# EAGLE design brelok_ext (EAGLE 8.3.2)
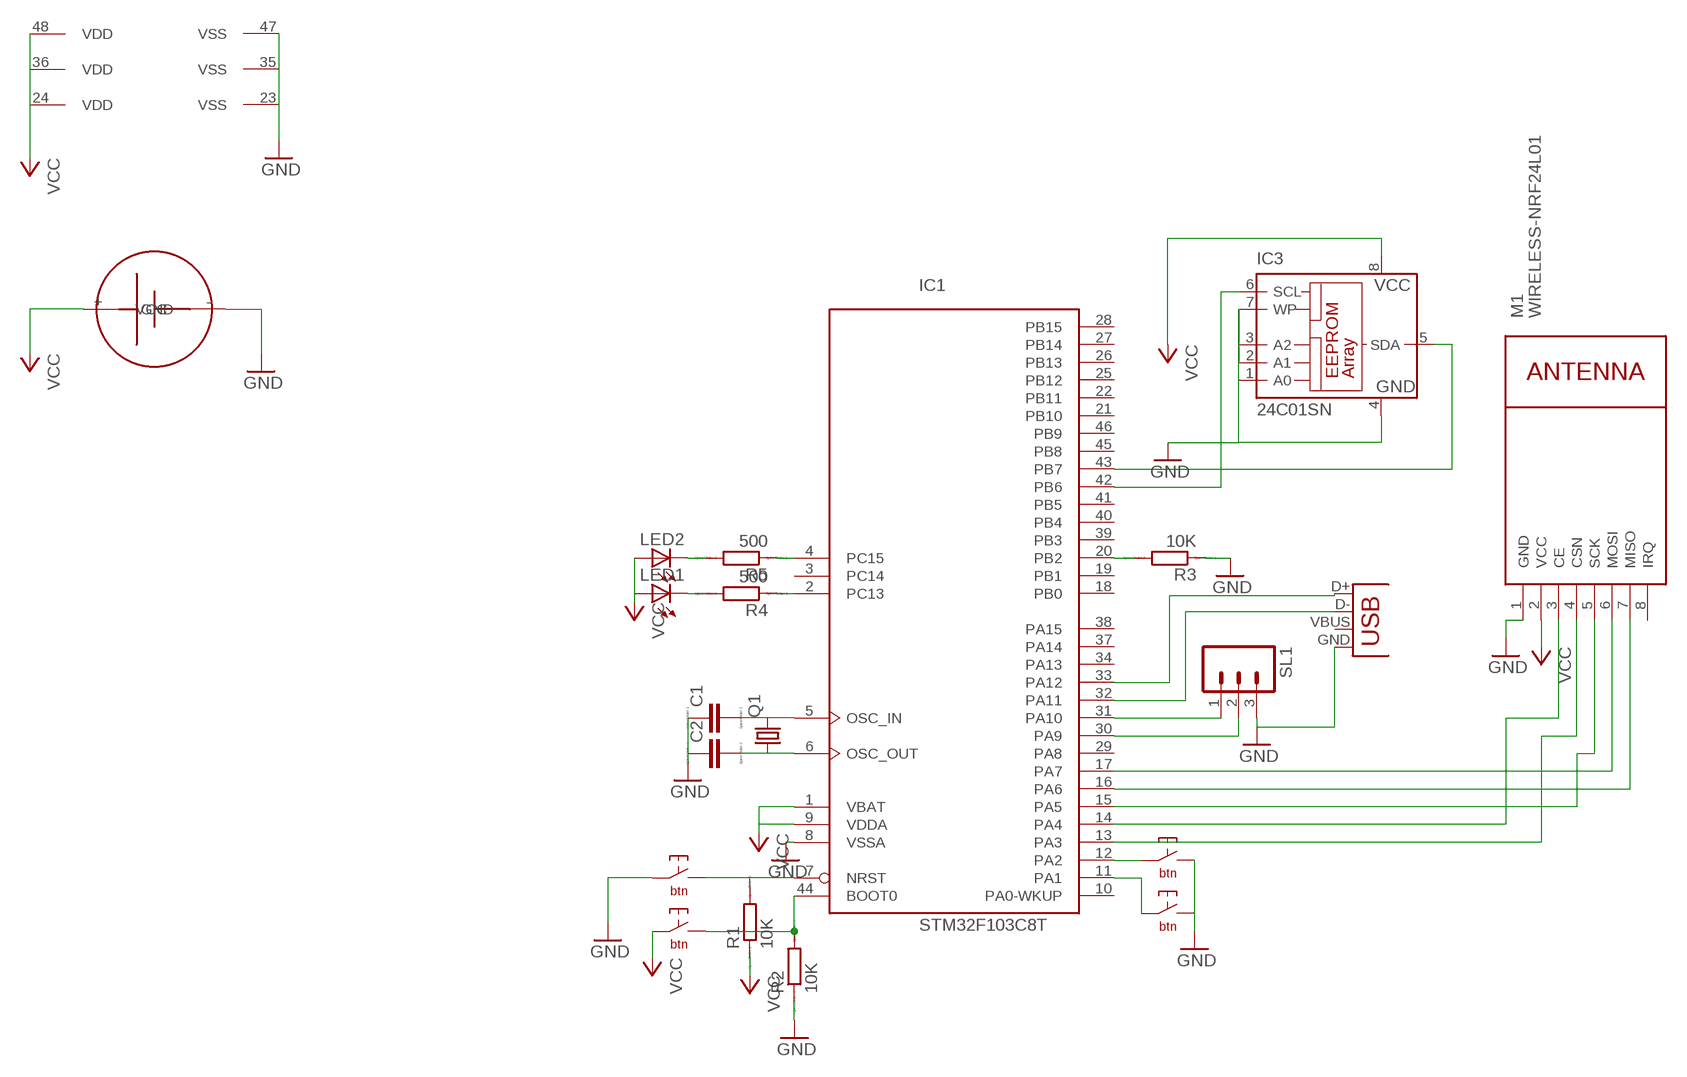
[diagram p0: schematic, sheet 1]

## Parts
BOOT  TM1103  [TM1103]
C1  CC0504  [C0504]
C2  CC0504  [C0504]
IC1  STM32F103C8T  [LQFP48]
IC3  24C01SN  [SO-08]
LED1  LEDCHIP-LED0805  [CHIP-LED0805]
LED2  LEDCHIP-LED0805  [CHIP-LED0805]
M1  WIRELESS-NRF24L01  [WIRELESS-NRF24L01]
Q1  CRYSTALHC49UP  [HC49UP]
R1  10K  R  [R0805]
R2  10K  R  [R0805]
R3  10K  R  [R0805]
R4  500  R  [R0805]
R5  500  R  [R0805]
RESET  TM1103  [TM1103]
SL1  M03  [03P]
U$2  CR2025_SMD  [SMD]
USER1  TM1103  [TM1103]
USER2  TM1103  [TM1103]
X1  SPARKFUN_USB-MICROB  [SPARKFUN_USB-MICROB]

## Nets
GND: C1.1 C2.1 IC1.8(VSSA) IC1.23(VSS) IC1.35(VSS) IC1.47(VSS) IC3.1(A0) IC3.2(A1) IC3.3(A2) IC3.4(GND) IC3.7(WP) M1.1(GND) R2.1 R3.1 RESET.P$2 SL1.3 U$2.-(GND) USER1.P$1 USER2.P$1 X1.GND
N$1: IC1.17(PA7) M1.6(MOSI)
N$2: IC1.16(PA6) M1.7(MISO)
N$3: IC1.15(PA5) M1.5(SCK)
N$4: IC1.14(PA4) M1.3(CE)
N$5: IC1.13(PA3) M1.4(CSN)
N$6: C1.2 IC1.5(OSC_IN) Q1.2
N$7: C2.2 IC1.6(OSC_OUT) Q1.1
N$8: IC1.7(NRST) R1.2 RESET.P$1
N$9: BOOT.P$1 IC1.44(BOOT0) R2.2
N$10: IC1.31(PA10) SL1.1
N$11: IC1.20(PB2) R3.2
N$12: IC1.30(PA9) SL1.2
N$13: LED1.C R4.2
N$14: LED2.C R5.2
N$15: IC1.4(PC15) R5.1
N$16: IC1.2(PC13) R4.1
N$18: IC1.12(PA2) USER2.P$2
N$19: IC1.11(PA1) USER1.P$2
N$21: IC1.42(PB6) IC3.6(SCL)
N$22: IC1.43(PB7) IC3.5(SDA)
N$23: IC1.32(PA11) X1.D-
N$24: IC1.33(PA12) X1.D+
VCC: BOOT.P$2 IC1.1(VBAT) IC1.9(VDDA) IC1.24(VDD) IC1.36(VDD) IC1.48(VDD) IC3.8(VCC) LED1.A LED2.A M1.2(VCC) R1.1 U$2.+(VCC)
Unconnected: IC1.3(PC14) IC1.10(PA0-WKUP) IC1.18(PB0) IC1.19(PB1) IC1.21(PB10) IC1.22(PB11) IC1.25(PB12) IC1.26(PB13) IC1.27(PB14) IC1.28(PB15) IC1.29(PA8) IC1.34(PA13) IC1.37(PA14) IC1.38(PA15) IC1.39(PB3) IC1.40(PB4) IC1.41(PB5) IC1.45(PB8) IC1.46(PB9) M1.8(IRQ) X1.VBUS

## Library data of the parts
BOOT RESET USER1 USER2 = tm1103:TM1103
C1 C2 = eagle-ltspice:C: CAPACITOR, European symbol; SPICEMODEL: NONE; SPICEPREFIX: C
IC1 = micro-stm_v2:STM32F103C*T: ARM 32-bit Cortex™-M3 CPU 72 MHz maximum frequency 16 to 128 Kbytes of Flash memory 6 to 20 kbytes of SRAM 37 GPIOs 2.0 to 3.6 V application supply
IC3 = microchip:24C*: Serial EEPROM 1 K/2 K/4 K; MPN: CAT24C01WI-GT3; OC_FARNELL: 1718117; OC_NEWARK: 06R0487
LED1 LED2 = led:LED: LED OSRAM: - CHIPLED LG R971, LG N971, LY N971, LG Q971, LY Q971, LO R971, LY R971 LH N974, LH R974 LS Q976, LO Q976, LY Q976 LO Q996 - Hyper CHIPLED LW Q18S LB Q993, LB Q99A, LB R99A - SideLED LS A670, LO A670, LY A670, LG A670, LP A670 LB A673, LV A673, LT A673, LW A673 LH A674 LY A675 LS A676, LA A676, LO A676, LY A676, LW A676 LS A679, LY A679, LG A679 - Hyper Micro SIDELED® LS Y876, LA Y876, LO Y876, LY Y876 LT Y87S - SmartLED LW L88C, LW L88S LB L89C, LB L89S, LG L890 LS L89K, LO L89K, LY L89K LS L896, LA L896, LO L896, LY L896 - TOPLED LS T670, LO T670, LY T670, LG T670, LP T670 LSG T670, LSP T670, LSY T670, LOP T670, LYG T670 LG T671, LOG T671, LSG T671 LB T673, LV T673, LT T673, LW T673 LH T674 LS T676, LA T676, LO T676, LY T676, LB T676, LH T676, LSB T676, LW T676 LB T67C, LV T67C, LT T67C, LS T67K, LO T67K, LY T67K, LW E67C LS E67B, LA E67B, LO E67B, LY E67B, LB E67C, LV E67C, LT E67C LW T67C LS T679, LY T679, LG T679 LS T770, LO T770, LY T770, LG T770, LP T770 LB T773, LV T773, LT T773, LW T773 LH T774 LS E675, LA E675, LY E675, LS T675 LS T776, LA T776, LO T776, LY T776, LB T776 LHGB T686 LT T68C, LB T68C - Hyper Mini TOPLED® LB M676 - Mini TOPLED Santana® LG M470 LS M47K, LO M47K, LY M47K Source: http://www.osram.convergy.de LUXEON: - LUMILED® LXK2-PW12-R00, LXK2-PW12-S00, LXK2-PW14-U00, LXK2-PW14-V00 LXK2-PM12-R00, LXK2-PM12-S00, LXK2-PM14-U00 LXK2-PE12-Q00, LXK2-PE12-R00, LXK2-PE12-S00, LXK2-PE14-T00, LXK2-PE14-U00 LXK2-PB12-K00, LXK2-PB12-L00, LXK2-PB12-M00, LXK2-PB14-N00, LXK2-PB14-P00, LXK2-PB14-Q00 LXK2-PR12-L00, LXK2-PR12-M00, LXK2-PR14-Q00, LXK2-PR14-R00 LXK2-PD12-Q00, LXK2-PD12-R00, LXK2-PD12-S00 LXK2-PH12-R00, LXK2-PH12-S00 LXK2-PL12-P00, LXK2-PL12-Q00, LXK2-PL12-R00 Source: www.luxeon.com KINGBRIGHT: KA-3528ASYC Source: www.kingbright.com
M1 = diy-modules:WIRELESS-NRF24L01: 2.4 GHz Wireless Module based on NRF24L01 chip More details available here: http://www.electrodragon.com/w/NRF24L01 Click here to find device on ebay.com <http://www.ebay.com/sch/nrf24l01+arduino>
Q1 = crystal:CRYSTAL: CRYSTAL; OC_FARNELL: unknown; OC_NEWARK: unknown
R1-R5 = eagle-ltspice:R: RESISTOR, European symbol; SPICEMODEL: NONE; SPICEPREFIX: R
SL1 = con-amp-quick:M03: AMP QUICK CONNECTOR; OC_FARNELL: unknown; OC_NEWARK: unknown
U$2 = CR2025:CR2025_SMD
X1 = antduino:SPARKFUN_USB: USB Connectors USB-B-PTH is fully proven SKU : PRT-00139 USB-miniB is fully proven SKU : PRT-00587 USB-A-PCB is untested. USB-A-H is throughly reviewed, but untested. Spark Fun Electronics SKU : PRT-00437 USB-B-SMT is throughly reviewed, but untested. Needs silkscreen touching up. USB-A-S has not been used/tested USB-MB-H has not been used/tested

## Board
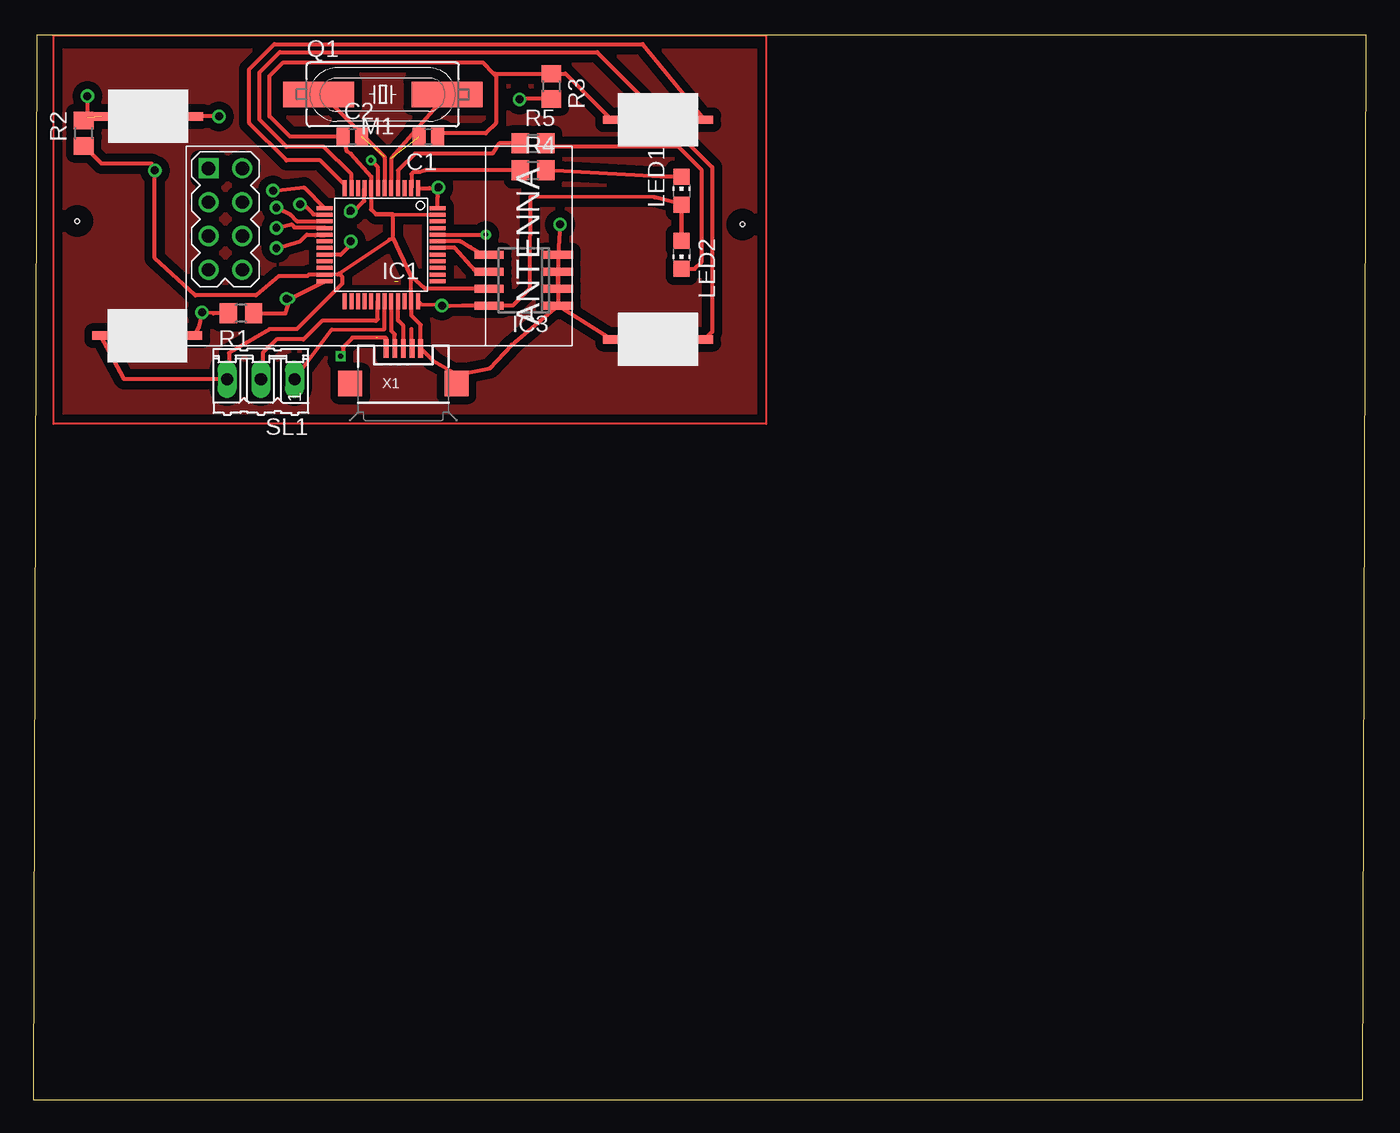
[diagram p1: board, top side]
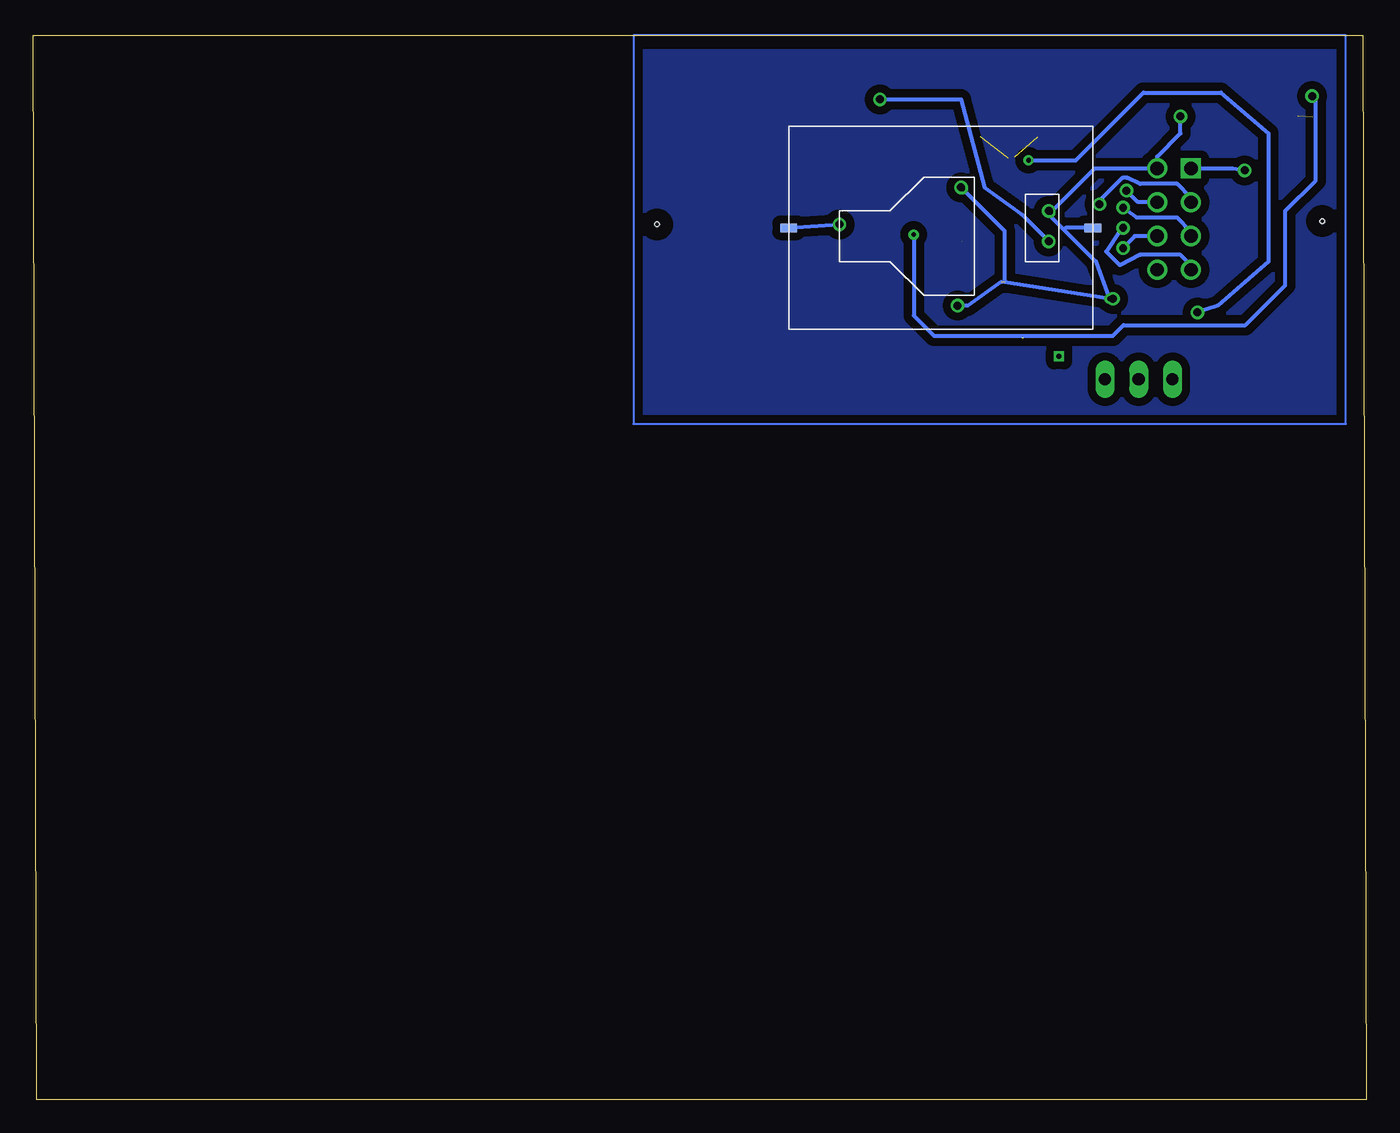
[diagram p2: board, bottom side, seen from below]

Size 100.25 x 80 mm. Coordinates in mm from the lower left corner, seen from the top.
Outline: 0,0 100,0 100.25,80 0.25,80 0,0
Copper layers (1*16): Top 0.035mm / dielectric 1.5mm / Bottom 0.035mm
Design rules "default": minimum track width 6mil, minimum drill 0.35mm, track to track 6mil, track to pad 6mil, pad to pad 6mil, via to via 6mil, smd to smd 6mil, copper to edge 40mil, drill to drill 6mil, minimum pad ring 10mil, minimum via ring 8mil, stop-mask expansion 4mil, vias tented up to drill 0mil, thermal gap 10mil
Holes 0.35 mm at 3.3,66.04 53.34,65.79

### Footprints (pad centres in the part's own frame; a part is rotated, then mirrored left to right if it is on the bottom)
TM1103 = smd 1.27 x 0.635: P$1 -3.5,0; P$2 3.5,0
C0504 = smd 1 x 1.3: 1 -0.7,0; 2 0.7,0
LQFP48 = smd 0.3 x 1.2: 1 -2.75,-4.25; 2 -2.25,-4.25; 3 -1.75,-4.25; 4 -1.25,-4.25; 5 -0.75,-4.25; 6 -0.25,-4.25; 7 0.25,-4.25; 8 0.75,-4.25; 9 1.25,-4.25; 10 1.75,-4.25; 11 2.25,-4.25; 12 2.75,-4.25; 25 2.75,4.25; 26 2.25,4.25; 27 1.75,4.25; 28 1.25,4.25; 29 0.75,4.25; 30 0.25,4.25; 31 -0.25,4.25; 32 -0.75,4.25; 33 -1.25,4.25; 34 -1.75,4.25; 35 -2.25,4.25; 36 -2.75,4.25 | smd 1.2 x 0.3: 13 4.25,-2.75; 14 4.25,-2.25; 15 4.25,-1.75; 16 4.25,-1.25; 17 4.25,-0.75; 18 4.25,-0.25; 19 4.25,0.25; 20 4.25,0.75; 21 4.25,1.25; 22 4.25,1.75; 23 4.25,2.25; 24 4.25,2.75; 37 -4.25,2.75; 38 -4.25,2.25; 39 -4.25,1.75; 40 -4.25,1.25; 41 -4.25,0.75; 42 -4.25,0.25; 43 -4.25,-0.25; 44 -4.25,-0.75; 45 -4.25,-1.25; 46 -4.25,-1.75; 47 -4.25,-2.25; 48 -4.25,-2.75
SO-08 = smd 0.6 x 2.2: 1 -1.905,-2.6; 2 -0.635,-2.6; 3 0.635,-2.6; 4 1.905,-2.6; 5 1.905,2.6; 6 0.635,2.6; 7 -0.635,2.6; 8 -1.905,2.6
CHIP-LED0805 = smd 1.2 x 1.2: A 0,-1.05; C 0,1.05
WIRELESS-NRF24L01 = drill 1 square: 1 -12.7,6.35 | drill 1: 2 -10.16,6.35; 3 -12.7,3.81; 4 -10.16,3.81; 5 -12.7,1.27; 6 -10.16,1.27; 7 -12.7,-1.27; 8 -10.16,-1.27
HC49UP = smd 5.334 x 1.93: 1 -4.826,0; 2 4.826,0
R0805 = smd 1.3 x 1.5: 1 -0.95,0; 2 0.95,0
03P = drill 0.914 long: 1 -2.54,0; 2 0,0; 3 2.54,0
SMD = smd 1.27 x 0.635: + 22.86,0; - 0,0
SPARKFUN_USB-MICROB = smd 0.35 x 1.4: D+ 0,2.65; D- -0.65,2.65; GND 1.3,2.65; ID 0.65,2.65; VBUS -1.3,2.65 | smd 1.8 x 1.9: MT1 -4,0; MT2 4,0

### Placement (x,y rotation side)
BOOT  8.64,73.91 0 top
C1  29.72,72.39 180 top
C2  24,72.39 0 top
IC1  26.18,64.27 180 top
IC3  36.88,61.59 90 top
LED1  48.77,68.33 0 top
LED2  48.77,63.5 180 top
M1  25.88,63.65 0 top
Q1  26.29,75.56 0 top
R1  15.62,59.11 180 top
R2  3.81,72.64 90 top
R3  38.96,76.17 270 top
R4  37.59,69.85 0 top
R5  37.59,71.88 0 top
RESET  8.59,57.43 180 top
SL1  17.12,54.15 180 top
U$2  43.43,65.53 0 bottom
USER1  46.99,57.15 0 top
USER2  46.99,73.66 0 top
X1  27.84,53.82 0 top

### Tracks (layer width: path | path; a pad name or v marks a point on that pad's centre or on a via)
GND  (via drill 0.35, 0.6 pad 0.6)
  Top 0.305: 22.99,62.1 23.24,61.85 23.24,61.34 19.81,57.91 17.78,57.91 14.73,56.13 14.73,54.38 14.5,54.15 | 22.99,62.1 22.9,62.03 IC1.23 20.73,62.02 20.6,61.9 18.46,61.9 16.76,60.45 12.19,60.45 9.14,63.25 v9.14,69.85 8.89,70.36 5.15,70.36 R2.1 | 25.78,66.55 25.4,66.93 IC1.8 25.43,68.75 25.43,69.39 23.88,71.12 23.61,71.26 C2.1 19.3,72.39 17.78,73.91 17.78,76.96 18.8,77.98 33.78,77.98 34.67,77.09 | 25.78,66.55 30.36,66.52 IC1.47 | 22.99,62.1 26.8,64.64 27.05,64.77 | 27.05,64.77 27.05,66.55 25.78,66.55 | 14.5,54.15 14.3,53.92 | 28.4,61.9 IC1.35 28.45,60 28.45,58.93 29.14,58.24 X1.GND 30.05,55.56 30.05,55.55 31.88,54.48 34.34,54.99 36,56.76 IC3.1 | 28.4,61.9 27.05,64.77 | IC3.3 IC3.4 v39.62,65.79 | 43.13,57.15 43.17,57.1 43.18,57.28 USER1.P$1 IC3.1 | IC3.7 29.46,60.96 28.4,61.9 | IC3.3 IC3.1 | IC3.2 IC3.3 | 34.67,77.09 34.8,76.96 34.8,73.41 34.04,72.64 30.67,72.64 C1.1 | 34.67,77.09 34.71,77.12 R3.1 40.02,77.12 USER2.P$1 | SL1.3 14.5,54.15 | 14.5,54.15 6.84,54.15 RESET.P$2
  Bottom 0.305: M1.1 10.05,70 v9.14,69.85 | U$2.- v39.62,65.79
N$1  (via drill 0.35, 0.6 pad 0.6)
  Top 0.305: 21.59,64.97 21.2,64.97 | 21.59,64.97 21.88,64.97 IC1.17 | v18.29,64.01 20.07,64.52 20.57,65.02 21.54,65.02 21.59,64.97
  Bottom 0.305: M1.6 17.42,64.92 v18.29,64.01
N$2  (via drill 0.35, 0.6 pad 0.6)
  Top 0.305: v18.29,65.53 19.42,65.79 19.64,65.56 21.89,65.56 IC1.16
  Bottom 0.305: M1.7 13.18,62.71 13.97,63.5 17.02,63.5 18.54,62.74 19.56,63.75 18.54,65.28 v18.29,65.53
N$3  (via drill 0.35, 0.6 pad 0.6)
  Top 0.305: v18.29,67.06 19.3,66.55 19.81,66.04 21.91,66.04 IC1.15
  Bottom 0.305: M1.5 13.18,65.25 14.22,66.29 17.27,66.29 v18.29,67.06
N$4  (via drill 0.35, 0.6 pad 0.6)
  Top 0.305: IC1.14 21.9,66.55 21.79,66.55 21.78,66.55 21.08,66.55 20.32,67.31 v20.07,67.31
  Bottom 0.305: M1.3 13.18,67.79 14.22,68.83 17.02,68.83 17.98,69.29 18.34,69.29 20.07,67.56 v20.07,67.31
N$5  (via drill 0.35, 0.6 pad 0.6)
  Top 0.305: v18.03,68.33 20.37,68.58 IC1.13
  Bottom 0.305: M1.4 17.17,67.46 v18.03,68.33
N$6  (1 unrouted)
  Top 0.305: Q1.2 26.92,70.75 IC1.5
N$7  (1 unrouted)
  Top 0.305: Q1.1 21.72,75.56 26.42,70.87 26.42,68.53 IC1.6
N$8  (via drill 0.35, 0.6 pad 0.6)
  Top 0.305: IC1.7 25.93,70.08 v25.4,70.61 | RESET.P$1 12.45,58.04 v12.7,59.18 13.54,59.11 R1.2
  Bottom 0.305: v25.4,70.61 21.84,70.61 16.76,75.69 10.92,75.69 7.37,72.64 7.37,62.99 11.18,59.69 v12.7,59.18
N$9  (via drill 0.35, 0.6)  (1 unrouted)
  Top 0.305: IC1.44 v34.03,65.02 v34.04,65.02 | v4.06,75.44 4.06,73.85 R2.2
  Bottom 0.305: v34.04,65.02 34.04,58.93 32.51,57.4 19.06,57.4 18.25,58.22 9.09,58.22 6.1,61.21 6.1,66.8 3.81,69.09 3.81,75.18 v4.06,75.44
N$10
  Top 0.305: SL1.1 22.45,57.89 26.42,57.91 26.42,60.06 IC1.31
N$11  (via drill 0.35, 0.6 pad 0.6)
  Top 0.305: R3.2 36.62,75.22 v36.58,75.18 | v23.88,64.52 23.88,64.26 23.11,63.5 21.95,63.5 IC1.20
  Bottom 0.305: v36.58,75.18 30.48,75.18 28.7,68.58 25.91,66.55 v23.88,64.52
N$12
  Top 0.305: 17.14,54.34 SL1.2 | 17.14,54.34 17.25,55.14 | IC1.30 25.91,60.06 25.91,58.67 25.78,58.55 21.72,58.55 20.32,57.15 18.29,57.15 17.27,56.13 17.27,54.47 17.14,54.34
N$13
  Top 0.305: LED1.C 47.21,69.38 R4.2
N$14
  Top 0.305: LED2.C 49.75,62.45 50.29,62.99 50.29,69.85 48.51,71.63 38.8,71.63 R5.2
N$15
  Top 0.305: R5.1 35.05,71.88 34.54,71.12 28.7,71.12 27.43,69.85 IC1.4
N$16
  Top 0.305: R4.1 29.46,69.85 29.08,69.72 28.57,69.72 28.45,69.6 28.45,68.62 IC1.2
N$17
  Top 0.152: 1.52,80.01 55.12,80.01 55.12,50.8 1.52,50.8 1.52,80.01
N$18
  Top 0.305: IC1.12 23.43,68.77 21.59,70.61 19.05,70.61 16.26,73.41 16.26,77.47 18.13,79.34 45.83,79.34 USER2.P$2
N$19
  Top 0.305: IC1.11 23.93,69.54 21.84,71.63 19.05,71.63 17.02,73.66 17.02,77.22 18.54,78.74 42.42,78.74 51.05,70.1 51.05,57.71 USER1.P$2
N$21
  Top 0.305: IC1.42 30.45,64.03 31.69,64.05 33.28,62.26 IC3.6
N$22  (1 unrouted)
  Top 0.305: 30.4,64.52 32.13,64.52 32.86,64.09 33.95,63.45 IC3.5
N$23
  Top 0.305: X1.D- 27.19,57.52 26.95,57.76 26.95,60 IC1.32
N$24
  Top 0.305: X1.D+ 27.84,58.17 27.43,58.57 IC1.33
N$25  (via drill 0.35)
  other vias: 23.11,55.88
N$26  (1 unrouted)
  Top 0.305: 26.54,57.1 26.54,57.2 26.47,57.28 25.78,57.28 | 25.91,57.28 24,57.28 23.29,56.56 23.29,56.05 23.11,55.88
N$27
  Top 0.305: 28.45,56.64 28.45,57.91
N$28  (via drill 0.6 pad 0.6)
  other vias: 30.73,59.69
N$29  (via drill 0.6 pad 0.6)
  other vias: 23.88,66.8
N$30  (via drill 0.6 pad 0.6)
  other vias: 30.48,68.58
N$31  (via drill 0.6 pad 0.6)
  other vias: 19.05,60.2
N$32
  pour Top (isolate 0.61): 54.86,51.05 1.78,51.05 1.78,80.01 54.86,80.01
N$33
  pour Bottom (isolate 0.61): 1.78,51.05 54.61,51.05 54.61,79.5 1.78,79.5
N$34
  Bottom 0.152: 1.52,50.8 1.52,80.01 55.12,80.01 55.12,50.8 1.52,50.8
VCC  (via drill 0.35, 0.6 pad 0.6)  (1 unrouted)
  Top 0.305: IC1.36 29.21,59.77 v30.75,59.7 31.3,59.64 32.27,59.69 IC3.8 36.07,59.69 37.34,60.96 37.34,61.98 37.37,67.85 46.74,67.82 48.77,67.31 LED2.A LED1.A | v23.75,66.67 24,66.67 24.89,67.56 24.89,68.48 IC1.9 | IC1.24 21.88,61.47 v19.3,60.2 18.97,59.11 R1.1 | v13.97,73.91 BOOT.P$2 | IC1.48 30.43,67.87 v30.35,68.45 29.78,68.52 IC1.1
  Bottom 0.305: v23.75,66.67 20.43,70 M1.2 15.72,70.89 13.97,72.64 v13.97,73.91 | 23.88,66.55 v23.75,66.67 | v23.75,66.67 23.75,66.42 22.73,65.41 | 22.73,65.41 20.32,62.99 v19.3,60.2 27.43,61.47 29.97,59.69 30.48,59.69 v30.75,59.7 | 27.18,61.47 27.18,65.28 v30.35,68.45 | U$2.+ 22.61,65.53 22.73,65.41